# EAGLE design schematic (EAGLE 8.4.3)
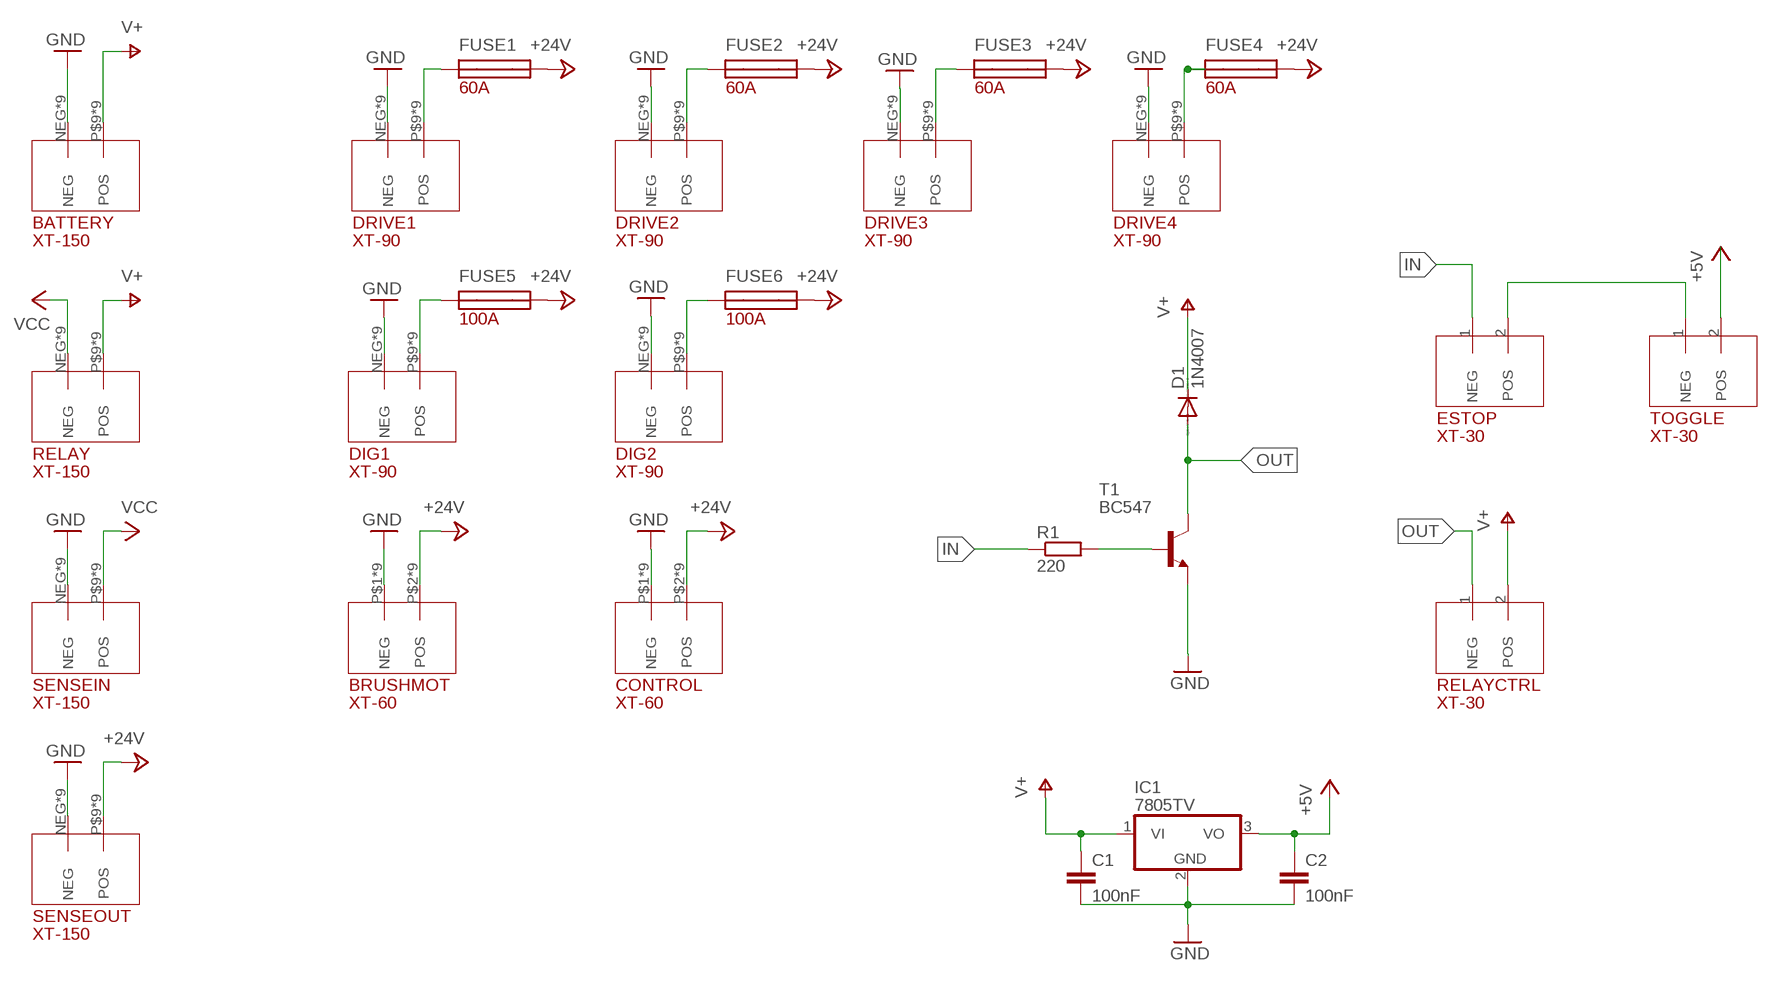
[diagram p0: schematic, sheet 1]

## Parts
BATTERY  XT-150  [XT-150]
BRUSHMOT  XT-60  [XT-60]
C1  100nF  C5/5  [C5B5]
C2  100nF  C5/5  [C5B5]
CONTROL  XT-60  [XT-60]
D1  1N4007  1N4004  [DO41-10]
DIG1  XT-90  [XT-90]
DIG2  XT-90  [XT-90]
DRIVE1  XT-90  [XT-90]
DRIVE2  XT-90  [XT-90]
DRIVE3  XT-90  [XT-90]
DRIVE4  XT-90  [XT-90]
ESTOP  XT-30  [XT-30]
FUSE1  60A  FUSE  [3555]
FUSE2  60A  FUSE  [3555]
FUSE3  60A  FUSE  [3555]
FUSE4  60A  FUSE  [3555]
FUSE5  100A  FUSE  [3555]
FUSE6  100A  FUSE  [3555]
IC1  7805TV  [TO220V]
R1  220  R-EU_0204/7  [0204/7]
RELAY  XT-150  [XT-150]
RELAYCTRL  XT-30  [XT-30]
SENSEIN  XT-150  [XT-150]
SENSEOUT  XT-150  [XT-150]
T1  BC547  [TO92]
TOGGLE  XT-30  [XT-30]

## Nets
+5V: C2.1 IC1.3(VO) TOGGLE.2(POS)
+24V: BRUSHMOT.P$2(POS) BRUSHMOT.P$7(POS) BRUSHMOT.P$8(POS) BRUSHMOT.P$9(POS) BRUSHMOT.P$10(POS) BRUSHMOT.P$11(POS) BRUSHMOT.P$12(POS) BRUSHMOT.P$13(POS) BRUSHMOT.P$14(POS) CONTROL.P$2(POS) CONTROL.P$7(POS) CONTROL.P$8(POS) CONTROL.P$9(POS) CONTROL.P$10(POS) CONTROL.P$11(POS) CONTROL.P$12(POS) CONTROL.P$13(POS) CONTROL.P$14(POS) FUSE1.P$3 FUSE1.P$4 FUSE2.P$3 FUSE2.P$4 FUSE3.P$3 FUSE3.P$4 FUSE4.P$3 FUSE4.P$4 FUSE5.P$3 FUSE5.P$4 FUSE6.P$3 FUSE6.P$4 SENSEOUT.P$9(POS) SENSEOUT.P$10(POS) SENSEOUT.P$11(POS) SENSEOUT.P$12(POS) SENSEOUT.P$13(POS) SENSEOUT.P$14(POS) SENSEOUT.P$15(POS) SENSEOUT.P$16(POS) SENSEOUT.POS
GND: BATTERY.NEG BATTERY.P$1(NEG) BATTERY.P$2(NEG) BATTERY.P$3(NEG) BATTERY.P$4(NEG) BATTERY.P$5(NEG) BATTERY.P$6(NEG) BATTERY.P$7(NEG) BATTERY.P$8(NEG) BRUSHMOT.P$1(NEG) BRUSHMOT.P$3(NEG) BRUSHMOT.P$4(NEG) BRUSHMOT.P$5(NEG) BRUSHMOT.P$6(NEG) BRUSHMOT.P$15(NEG) BRUSHMOT.P$16(NEG) BRUSHMOT.P$17(NEG) BRUSHMOT.P$18(NEG) C1.2 C2.2 CONTROL.P$1(NEG) CONTROL.P$3(NEG) CONTROL.P$4(NEG) CONTROL.P$5(NEG) CONTROL.P$6(NEG) CONTROL.P$15(NEG) CONTROL.P$16(NEG) CONTROL.P$17(NEG) CONTROL.P$18(NEG) DIG1.NEG DIG1.P$1(NEG) DIG1.P$2(NEG) DIG1.P$3(NEG) DIG1.P$4(NEG) DIG1.P$5(NEG) DIG1.P$6(NEG) DIG1.P$7(NEG) DIG1.P$8(NEG) DIG2.NEG DIG2.P$1(NEG) DIG2.P$2(NEG) DIG2.P$3(NEG) DIG2.P$4(NEG) DIG2.P$5(NEG) DIG2.P$6(NEG) DIG2.P$7(NEG) DIG2.P$8(NEG) DRIVE1.NEG DRIVE1.P$1(NEG) DRIVE1.P$2(NEG) DRIVE1.P$3(NEG) DRIVE1.P$4(NEG) DRIVE1.P$5(NEG) DRIVE1.P$6(NEG) DRIVE1.P$7(NEG) DRIVE1.P$8(NEG) DRIVE2.NEG DRIVE2.P$1(NEG) DRIVE2.P$2(NEG) DRIVE2.P$3(NEG) DRIVE2.P$4(NEG) DRIVE2.P$5(NEG) DRIVE2.P$6(NEG) DRIVE2.P$7(NEG) DRIVE2.P$8(NEG) DRIVE3.NEG DRIVE3.P$1(NEG) DRIVE3.P$2(NEG) DRIVE3.P$3(NEG) DRIVE3.P$4(NEG) DRIVE3.P$5(NEG) DRIVE3.P$6(NEG) DRIVE3.P$7(NEG) DRIVE3.P$8(NEG) DRIVE4.NEG DRIVE4.P$1(NEG) DRIVE4.P$2(NEG) DRIVE4.P$3(NEG) DRIVE4.P$4(NEG) DRIVE4.P$5(NEG) DRIVE4.P$6(NEG) DRIVE4.P$7(NEG) DRIVE4.P$8(NEG) IC1.2(GND) SENSEIN.NEG SENSEIN.P$1(NEG) SENSEIN.P$2(NEG) SENSEIN.P$3(NEG) SENSEIN.P$4(NEG) SENSEIN.P$5(NEG) SENSEIN.P$6(NEG) SENSEIN.P$7(NEG) SENSEIN.P$8(NEG) SENSEOUT.NEG SENSEOUT.P$1(NEG) SENSEOUT.P$2(NEG) SENSEOUT.P$3(NEG) SENSEOUT.P$4(NEG) SENSEOUT.P$5(NEG) SENSEOUT.P$6(NEG) SENSEOUT.P$7(NEG) SENSEOUT.P$8(NEG) T1.1(E)
IN: ESTOP.1(NEG) R1.1
N$1: ESTOP.2(POS) TOGGLE.1(NEG)
N$2: DIG2.P$9(POS) DIG2.P$10(POS) DIG2.P$11(POS) DIG2.P$12(POS) DIG2.P$13(POS) DIG2.P$14(POS) DIG2.P$15(POS) DIG2.P$16(POS) DIG2.POS FUSE6.P$1 FUSE6.P$2
N$3: DIG1.P$9(POS) DIG1.P$10(POS) DIG1.P$11(POS) DIG1.P$12(POS) DIG1.P$13(POS) DIG1.P$14(POS) DIG1.P$15(POS) DIG1.P$16(POS) DIG1.POS FUSE5.P$1 FUSE5.P$2
N$4: DRIVE1.P$9(POS) DRIVE1.P$10(POS) DRIVE1.P$11(POS) DRIVE1.P$12(POS) DRIVE1.P$13(POS) DRIVE1.P$14(POS) DRIVE1.P$15(POS) DRIVE1.P$16(POS) DRIVE1.POS FUSE1.P$1 FUSE1.P$2
N$5: DRIVE2.P$9(POS) DRIVE2.P$10(POS) DRIVE2.P$11(POS) DRIVE2.P$12(POS) DRIVE2.P$13(POS) DRIVE2.P$14(POS) DRIVE2.P$15(POS) DRIVE2.P$16(POS) DRIVE2.POS FUSE2.P$1 FUSE2.P$2
N$6: DRIVE3.P$9(POS) DRIVE3.P$10(POS) DRIVE3.P$11(POS) DRIVE3.P$12(POS) DRIVE3.P$13(POS) DRIVE3.P$14(POS) DRIVE3.P$15(POS) DRIVE3.P$16(POS) DRIVE3.POS FUSE3.P$1 FUSE3.P$2
N$7: DRIVE4.P$9(POS) DRIVE4.P$10(POS) DRIVE4.P$11(POS) DRIVE4.P$12(POS) DRIVE4.P$13(POS) DRIVE4.P$14(POS) DRIVE4.P$15(POS) DRIVE4.P$16(POS) DRIVE4.POS FUSE4.P$1 FUSE4.P$2
N$9: R1.2 T1.2(B)
OUT: D1.A RELAYCTRL.1(NEG) T1.3(C)
V+: BATTERY.P$9(POS) BATTERY.P$10(POS) BATTERY.P$11(POS) BATTERY.P$12(POS) BATTERY.P$13(POS) BATTERY.P$14(POS) BATTERY.P$15(POS) BATTERY.P$16(POS) BATTERY.POS C1.1 D1.C IC1.1(VI) RELAY.P$9(POS) RELAY.P$10(POS) RELAY.P$11(POS) RELAY.P$12(POS) RELAY.P$13(POS) RELAY.P$14(POS) RELAY.P$15(POS) RELAY.P$16(POS) RELAY.POS RELAYCTRL.2(POS)
VCC: RELAY.NEG RELAY.P$1(NEG) RELAY.P$2(NEG) RELAY.P$3(NEG) RELAY.P$4(NEG) RELAY.P$5(NEG) RELAY.P$6(NEG) RELAY.P$7(NEG) RELAY.P$8(NEG) SENSEIN.P$9(POS) SENSEIN.P$10(POS) SENSEIN.P$11(POS) SENSEIN.P$12(POS) SENSEIN.P$13(POS) SENSEIN.P$14(POS) SENSEIN.P$15(POS) SENSEIN.P$16(POS) SENSEIN.POS

## Library data of the parts
BATTERY RELAY SENSEIN SENSEOUT = connectors:XT-150
BRUSHMOT CONTROL = connectors:XT-60
C1 C2 = capacitor-wima:C: CAPACITOR naming: grid - package width
D1 = diode:1N4004: DIODE general purpose rectifier, 1 A
DIG1 DIG2 DRIVE1-DRIVE4 = connectors:XT-90
ESTOP RELAYCTRL TOGGLE = connectors:XT-30
FUSE1-FUSE6 = fuse:FUSE
IC1 = linear:78*: Positive VOLTAGE REGULATOR Source: http://cache.national.com/ds/LM/LM78L05.pdf http://www.fairchildsemi.com/ds/LM/LM7805.pdf
R1 = rcl:R-EU_: RESISTOR, European symbol
T1 = transistor:BC547: NPN TRANSISTOR

## Board
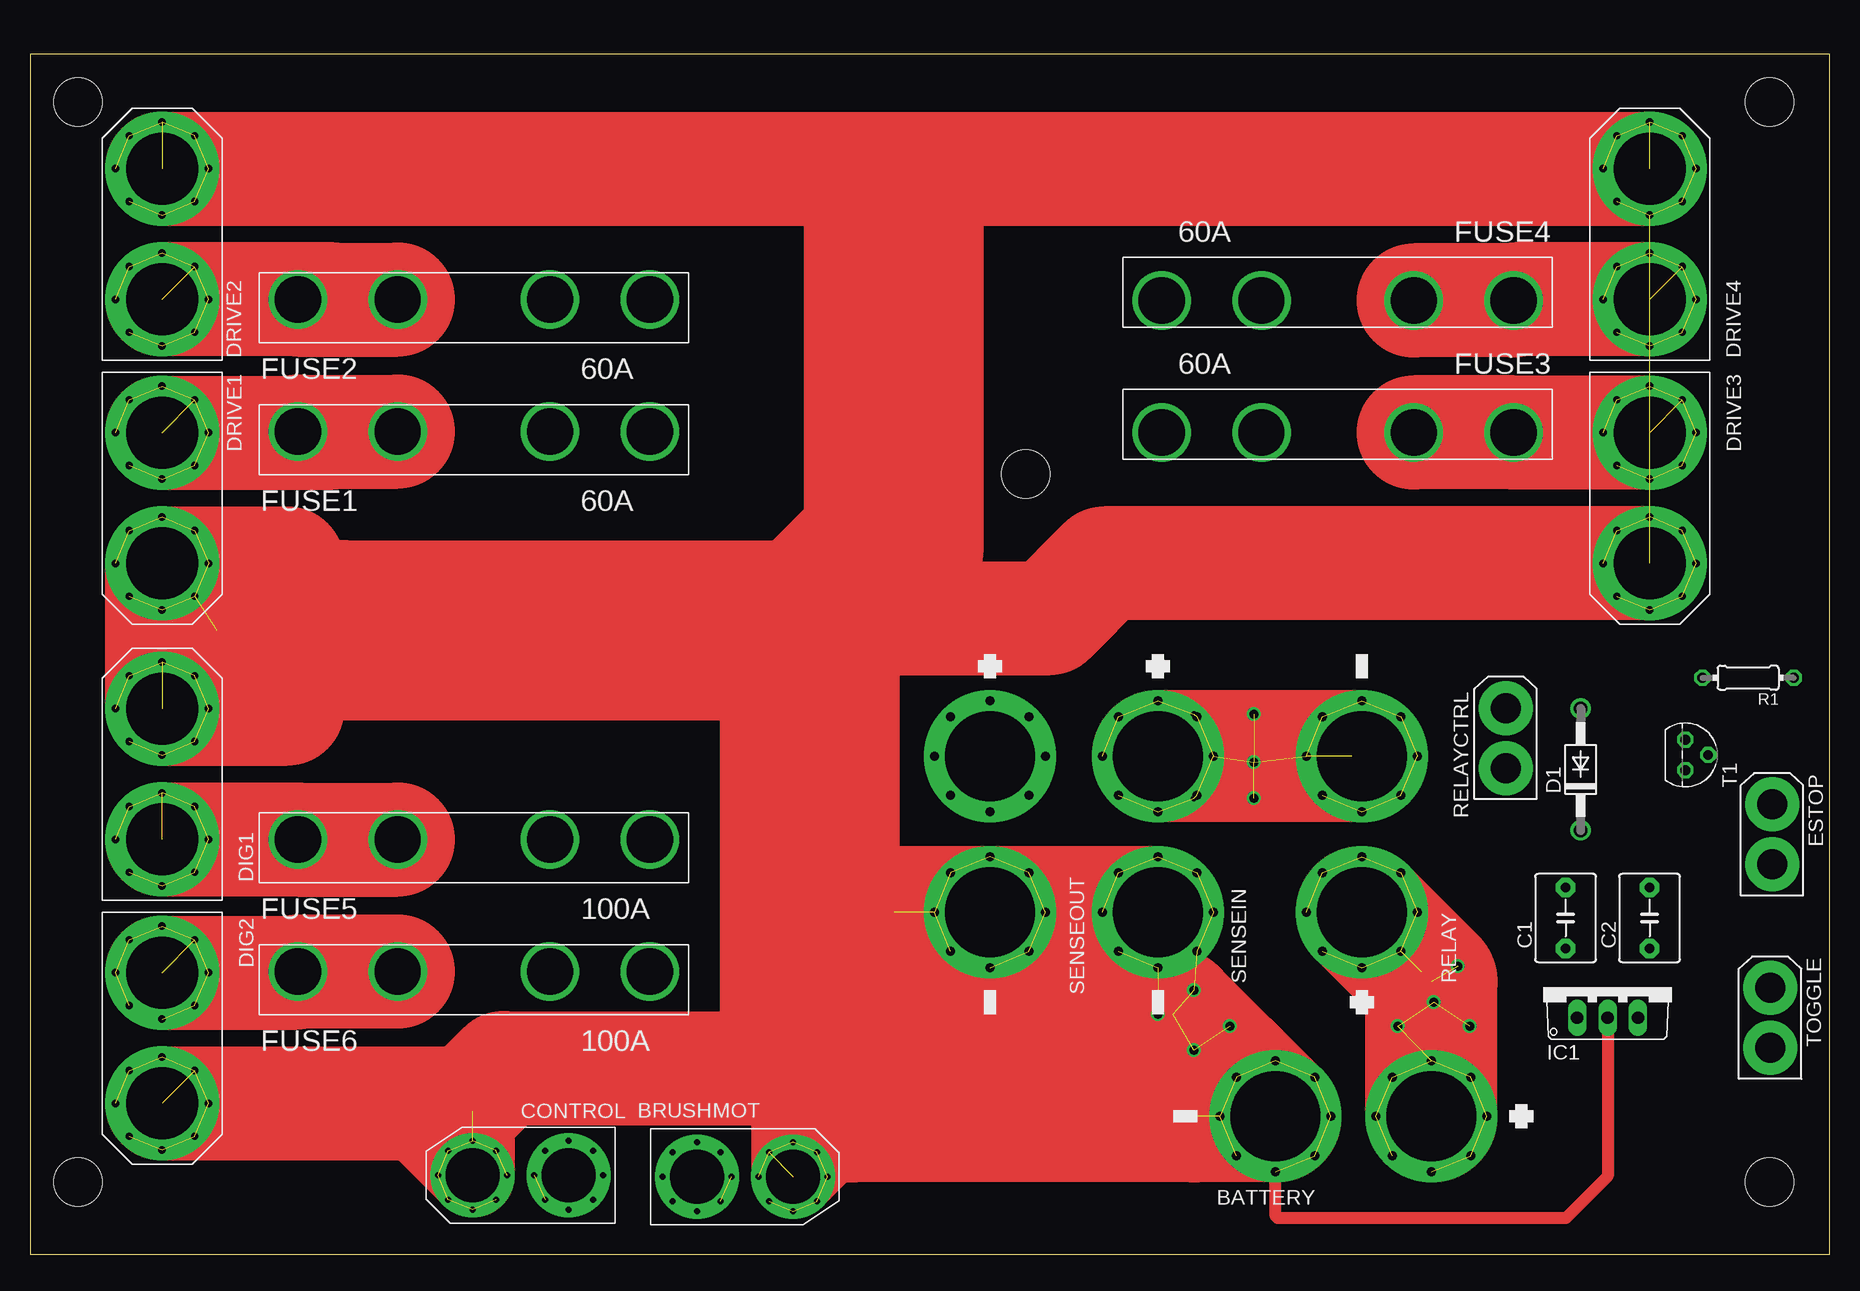
[diagram p1: board, top side]
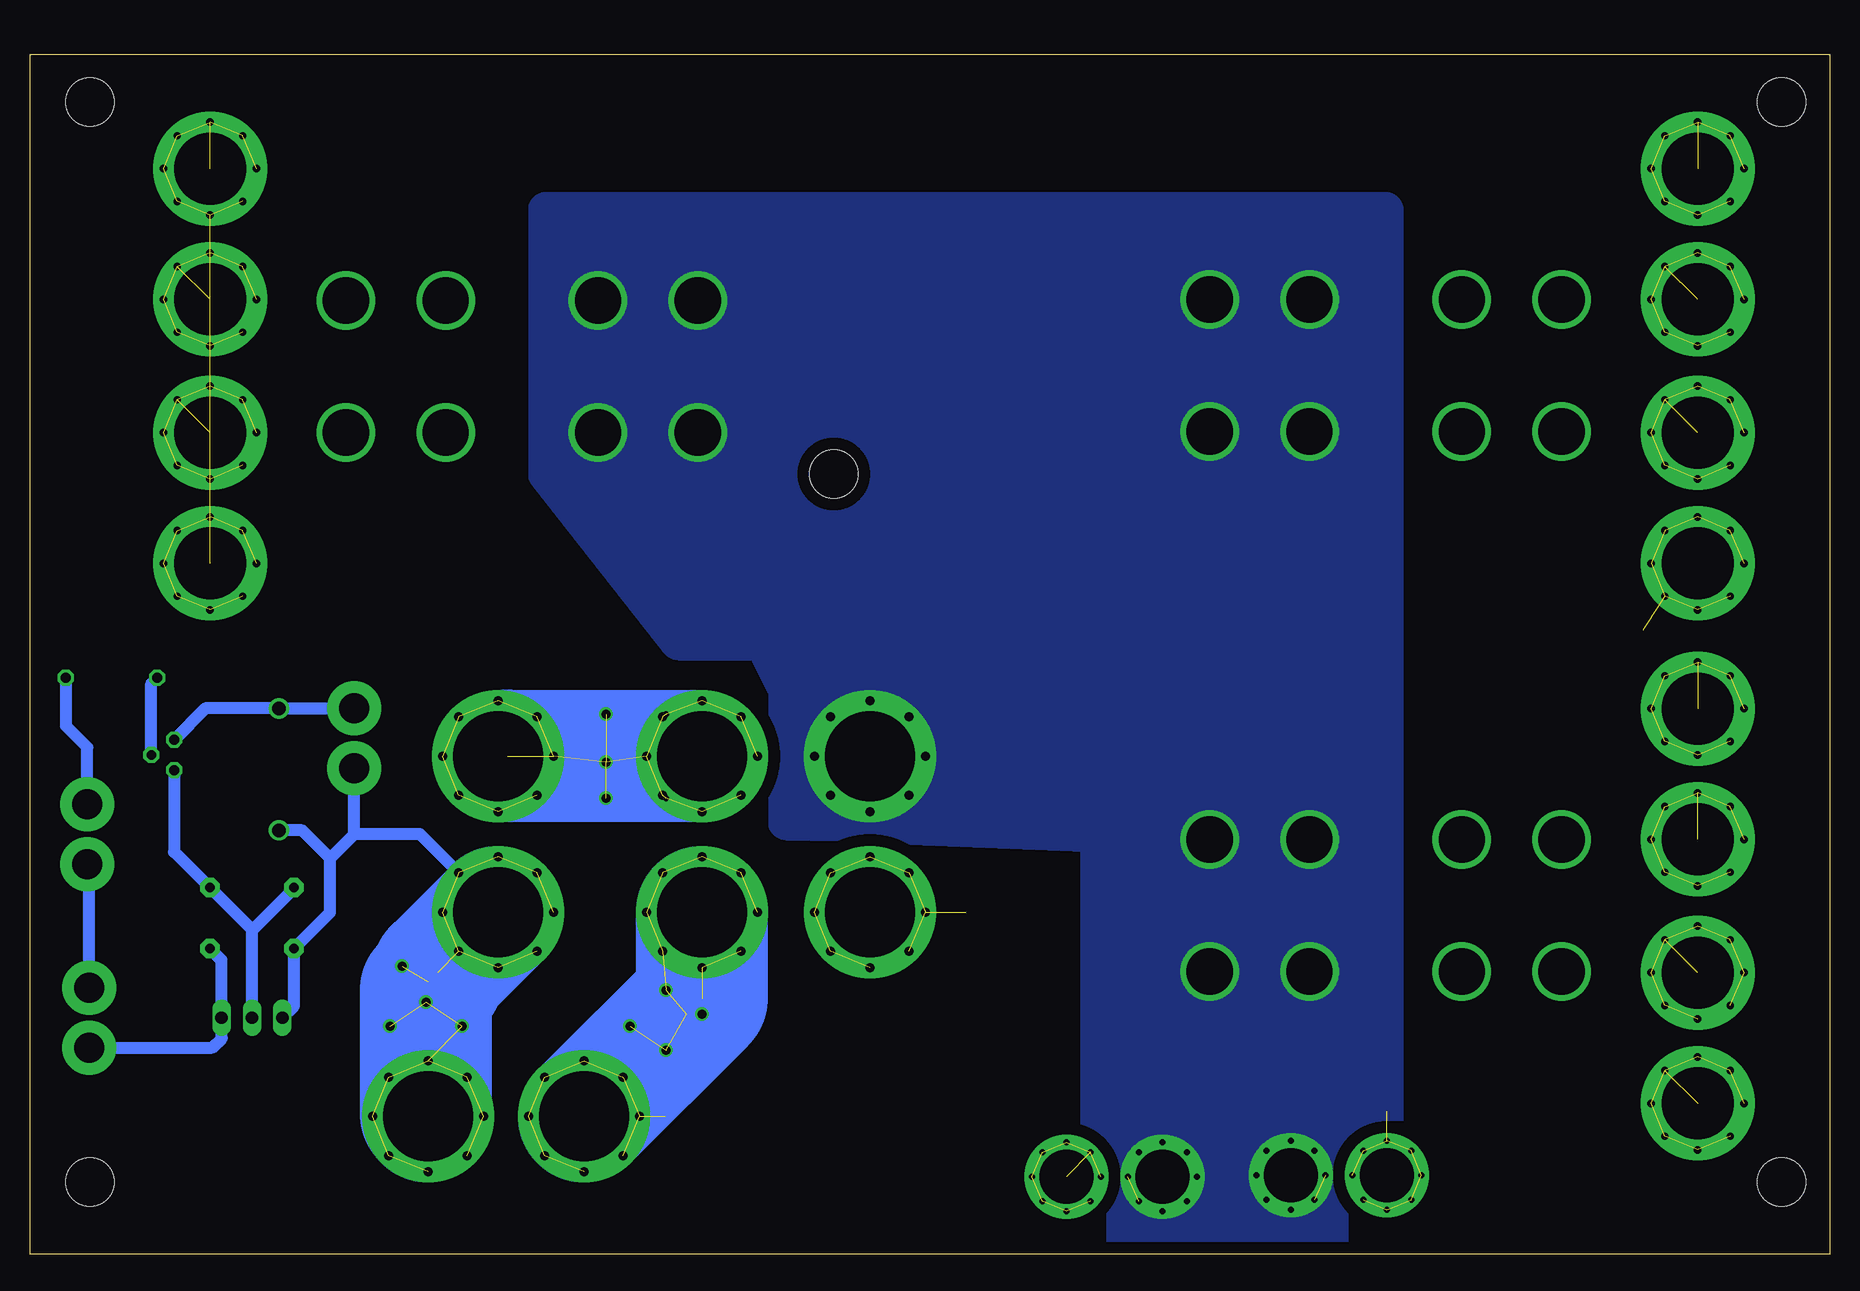
[diagram p2: board, bottom side, seen from below]

Size 150 x 100 mm. Coordinates in mm from the lower left corner, seen from the top.
Outline: 0,0 150,0 150,100 0,100 0,0
Copper layers (1*16): Top 0.035mm / dielectric 1.5mm / Bottom 0.035mm
Design rules "default": minimum track width 6mil, minimum drill 0.35mm, track to track 6mil, track to pad 6mil, pad to pad 6mil, via to via 6mil, smd to smd 6mil, copper to edge 40mil, drill to drill 6mil, minimum pad ring 10mil, minimum via ring 8mil, stop-mask expansion 4mil, vias tented up to drill 0mil, thermal gap 10mil
Holes 4 mm at 4,96 145,96 83,65 4,6 145,6

### Footprints (pad centres in the part's own frame; a part is rotated, then mirrored left to right if it is on the bottom)
XT-150 = drill 7.5 pad 11: NEG -6.5,0; POS 6.5,0 | drill 0.75: P$1 -6.5,4.625; P$2 -3.23,3.27; P$3 -1.875,0; P$4 -3.23,-3.27; P$5 -6.5,-4.625; P$6 -9.77,-3.27; P$7 -11.125,0; P$8 -9.77,3.27; P$9 6.5,4.625; P$10 9.77,3.27; P$11 11.125,0; P$12 9.77,-3.27; P$13 6.5,-4.625; P$14 3.23,-3.27; P$15 1.875,0; P$16 3.23,3.27
XT-60 = drill 4.5 pad 7: P$1 -4,0; P$2 4,0 | drill 0.5: P$3 -6.875,0; P$4 -4,-2.875; P$5 -1.125,0; P$6 -4,2.875; P$7 4,2.875; P$8 1.125,0; P$9 6.875,0; P$10 4,-2.875; P$11 6.03,-2.03; P$12 6.03,2.03; P$13 2.03,2.03; P$14 2.03,-2.03; P$15 -2.03,-2.03; P$16 -2.03,2.03; P$17 -6.03,2.03; P$18 -6.03,-2.03
C5B5 = drill 0.813 pad 1.6 octagon: 1 -2.54,0; 2 2.54,0
DO41-10 = drill 1.118: A 5.08,0; C -5.08,0
XT-90 = drill 6 pad 9.5: NEG -5.45,0; POS 5.45,0 | drill 0.6: P$1 -5.45,3.875; P$2 -2.71,2.74; P$3 -1.575,0; P$4 -2.71,-2.74; P$5 -5.45,-3.875; P$6 -8.19,-2.74; P$7 -9.325,0; P$8 -8.19,2.74; P$9 5.45,3.875; P$10 8.19,2.74; P$11 9.325,0; P$12 8.19,-2.74; P$13 5.45,-3.875; P$14 2.71,-2.74; P$15 1.575,0; P$16 2.71,2.74
XT-30 = drill 2.5 pad 4.5: 1 -2.5,0; 2 2.5,0
3555 = drill 3.86: P$1 -6.35,0.29; P$2 -14.675,0.29; P$3 6.35,0.29; P$4 14.675,0.29
TO220V = drill 1.016 long: 1 -2.54,-2.54; 2 0,-2.54; 3 2.54,-2.54
0204/7 = drill 0.813 octagon: 1 -3.81,0; 2 3.81,0
TO92 = drill 0.813 octagon: 1 1.27,0; 2 0,1.905; 3 -1.27,0

### Placement (x,y rotation side)
BATTERY  110.31,11.48 0 top
BRUSHMOT  59.59,6.44 180 top
C1  128,28 90 top
C2  135,28 90 top
CONTROL  40.9,6.56 0 top
D1  129.25,40.38 90 top
DIG1  11,40 270 top
DIG2  11,18 90 top
DRIVE1  11,63 90 top
DRIVE2  11,85 270 top
DRIVE3  135,63 90 top
DRIVE4  135,85 270 top
ESTOP  145.21,34.97 270 top
FUSE1  37,68.25 0 top
FUSE2  37,79.25 0 top
FUSE3  109,68.75 180 top
FUSE4  109,79.75 180 top
FUSE5  37,34.25 0 top
FUSE6  37,23.25 0 top
IC1  131.5,22.23 0 top
R1  143.21,48.02 180 top
RELAY  111,35 270 top
RELAYCTRL  123,43 270 top
SENSEIN  94,35 90 top
SENSEOUT  80,35 90 top
T1  137.98,41.59 270 top
TOGGLE  145.05,19.69 270 top

### Tracks (layer width: path | path; a pad name or v marks a point on that pad's centre or on a via)
+5V
  Bottom 1: C2.1 134.04,24.5 IC1.3 134.04,18.04 134,18 134.81,17.19 TOGGLE.2
+24V  (2 unrouted)
  Bottom 6: SENSEOUT.POS 81,42
  pour Bottom (isolate 1, no thermals): 37,2 37,87 107,87 107,65 96,51 89,51 87,47 87,36 86,36 61,35 61,2
GND  (via drill 0.75)  (92 unrouted)
  Top 1: IC1.2 131.5,6.5 128,3 104,3 103.81,3.19 BATTERY.NEG
  Top 11: SENSEIN.NEG SENSEOUT.NEG | 72,28.5 65.5,28.5 65,29 | BATTERY.NEG 68.52,11.48 66,14 66,27 68,29 | BATTERY.NEG 97.02,11.48 SENSEOUT.NEG | BATTERY.NEG 95.29,20 v94,20 70,20 72,22 72,28.5 | SENSEOUT.NEG 72,28.5
  Top 15: 26,52 65,52 | 65,52 72,59 72,87 | 65,52 65,29 65,17
  Top 7: 36.9,11.9 CONTROL.P$1 30.91,12.55 28,12.55 | 65,17 63.59,15.59 BRUSHMOT.P$1 72,14.85 72,28.5
  Top 8: DIG1.NEG 16.55,52 26,52 | DRIVE1.NEG 15.55,52 | 21.45,57.55 26,52 | 21.45,45.45 26,52
  Top 9.5: 21.45,57.55 DRIVE1.NEG DIG1.NEG 21.45,45.45 | DRIVE2.NEG DRIVE4.NEG | DIG2.NEG 28,12.55 36.55,12.55 39.49,15.49 61.34,15.49 67,21.15 67,26 69.5,28.5 72,28.5 | DRIVE3.NEG 89.55,57.55 85,53 66,53 65,52
  Bottom 1: T1.1 137.98,33.52 C2.2 131.5,27.04 131.5,27 | IC1.2 131.5,27 | 131.5,27 128,30.5 C1.2
  Bottom 11: BATTERY.NEG 94,21.29 SENSEIN.NEG
  other vias: 97,22 97,17 100,19
IN  (via drill 0.35)
  Top 1: v147,48 R1.1
  Bottom 1: ESTOP.1 145.21,42.21 147,44 v147,48
N$1  (via drill 0.35)
  Top 1: v145.05,32.31 ESTOP.2
  Bottom 1: TOGGLE.1 v145.05,32.31
N$2  (8 unrouted)
  Top 9.5: DIG2.POS 22.23,23.45 FUSE6.P$2 FUSE6.P$1
N$3  (8 unrouted)
  Top 9.5: DIG1.POS FUSE5.P$2 FUSE5.P$1
N$4  (8 unrouted)
  Top 9.5: DRIVE1.POS 25.23,68.45 FUSE1.P$2 FUSE1.P$1
N$5  (8 unrouted)
  Top 9.5: DRIVE2.POS 25.32,79.55 FUSE2.P$2 FUSE2.P$1
N$6  (8 unrouted)
  Top 9.5: DRIVE3.POS 123.69,68.45 FUSE3.P$2 FUSE3.P$1
N$7  (8 unrouted)
  Top 9.5: DRIVE4.POS 123.77,79.55 FUSE4.P$2 FUSE4.P$1
N$9
  Bottom 1: T1.2 139.88,47.53 R1.2
OUT
  Bottom 1: RELAYCTRL.1 123.04,45.46 D1.A 135.38,45.46 T1.3
V+  (via drill 0.75)  (19 unrouted)
  Top 11: BATTERY.POS 116.81,22.69 RELAY.POS
  Bottom 1: IC1.1 128,20.65 C1.1 125,28.46 125,33 | 125,33 127.3,35.3 D1.C | 123,35 125,33 | 123,35 RELAYCTRL.2 | RELAY.POS 117.5,35 123,35
  Bottom 11: RELAY.POS 116,23.5 116,23 | BATTERY.POS 117,11.66 v117,21 117,22
  other vias: 114,19 120,19 119,24
VCC  (via drill 0.5, 0.75)  (21 unrouted)
  Top 11: RELAY.NEG SENSEIN.POS
  Bottom 11: SENSEIN.POS 110.21,41.5 110.24,41.53
  other vias: 97,45 97,38 102,38 102,41 102,45